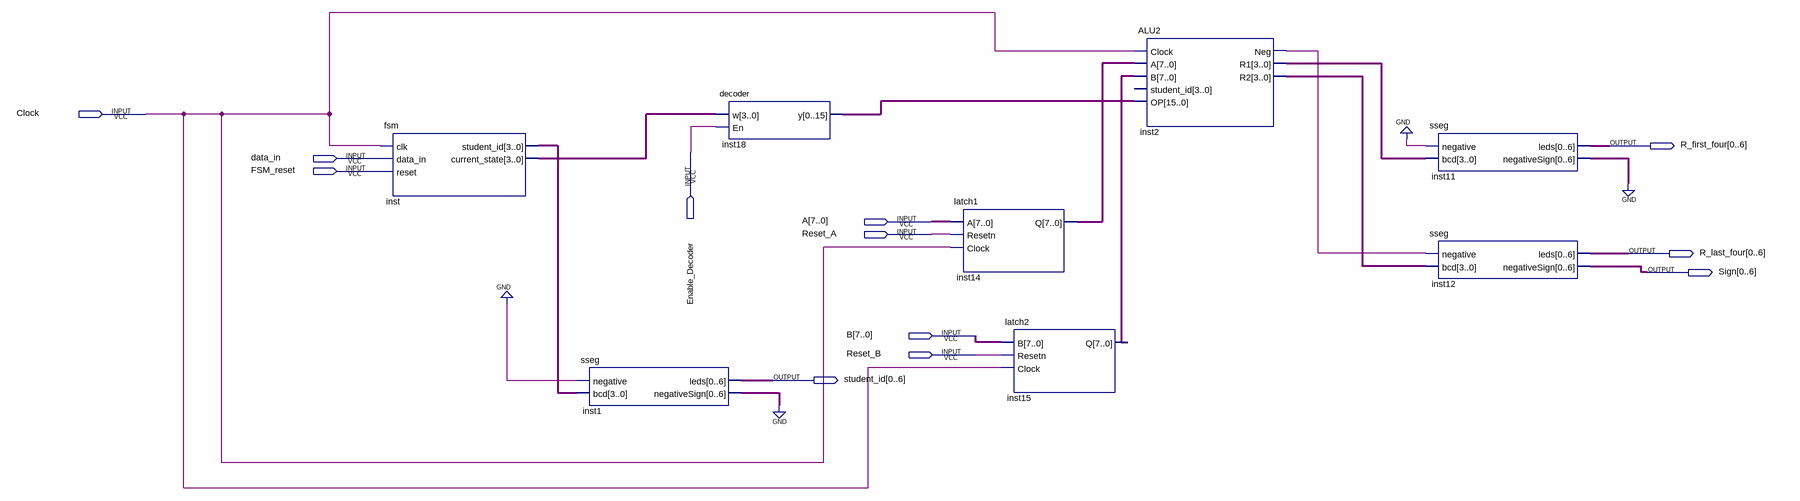
[diagram p0: schematic sheet]
// Quartus schematic part2.bdf as structural Verilog: 8 symbols, 12 pins
module part2 (
  input  Clock,
  input  Enable_Decoder,
  input  data_in,
  input  FSM_reset,
  input  [7:0] A,
  input  Reset_A,
  input  [7:0] B,
  input  Reset_B,
  output [0:6] R_first_four,
  output [0:6] R_last_four,
  output [0:6] Sign,
  output [0:6] student_id
);

  wire inst2_neg;
  wire [3:0] inst2_r1, inst2_r2, inst_current_state, inst_student_id;
  wire [6:0] inst1_negativesign, inst11_negativesign;
  wire [7:0] inst14_q, inst15_q;
  wire [15:0] inst18_y;

  fsm inst (
    .clk(Clock), .data_in(data_in), .reset(FSM_reset), .student_id(inst_student_id),
    .current_state(inst_current_state));
  sseg inst1 (.negative(1'b0), .bcd(inst_student_id), .leds(student_id), .negativeSign(inst1_negativesign));
  decoder inst18 (.w(inst_current_state), .En(Enable_Decoder), .y(inst18_y));
  latch1 inst14 (.A(A), .Resetn(Reset_A), .Clock(Clock), .Q(inst14_q));
  latch2 inst15 (.B(B), .Resetn(Reset_B), .Clock(Clock), .Q(inst15_q));
  ALU2 inst2 (
    .Clock(Clock), .A(inst14_q), .B(inst15_q), .OP(inst18_y), .Neg(inst2_neg), .R1(inst2_r1), .R2(inst2_r2));  // open: student_id
  sseg inst11 (.negative(1'b0), .bcd(inst2_r1), .leds(R_first_four), .negativeSign(inst11_negativesign));
  sseg inst12 (.negative(inst2_neg), .bcd(inst2_r2), .leds(R_last_four), .negativeSign(Sign));
  // also tied to GND on the sheet: {inst1_negativesign[0], inst1_negativesign[1], inst1_negativesign[2], inst1_negativesign[3], inst1_negativesign[4], inst1_negativesign[5], inst1_negativesign[6], inst11_negativesign[0], inst11_negativesign[1], inst11_negativesign[2], inst11_negativesign[3], inst11_negativesign[4], inst11_negativesign[5], inst11_negativesign[6]}
endmodule
